# EAGLE schematic GPSClock (EAGLE 6.5.0)
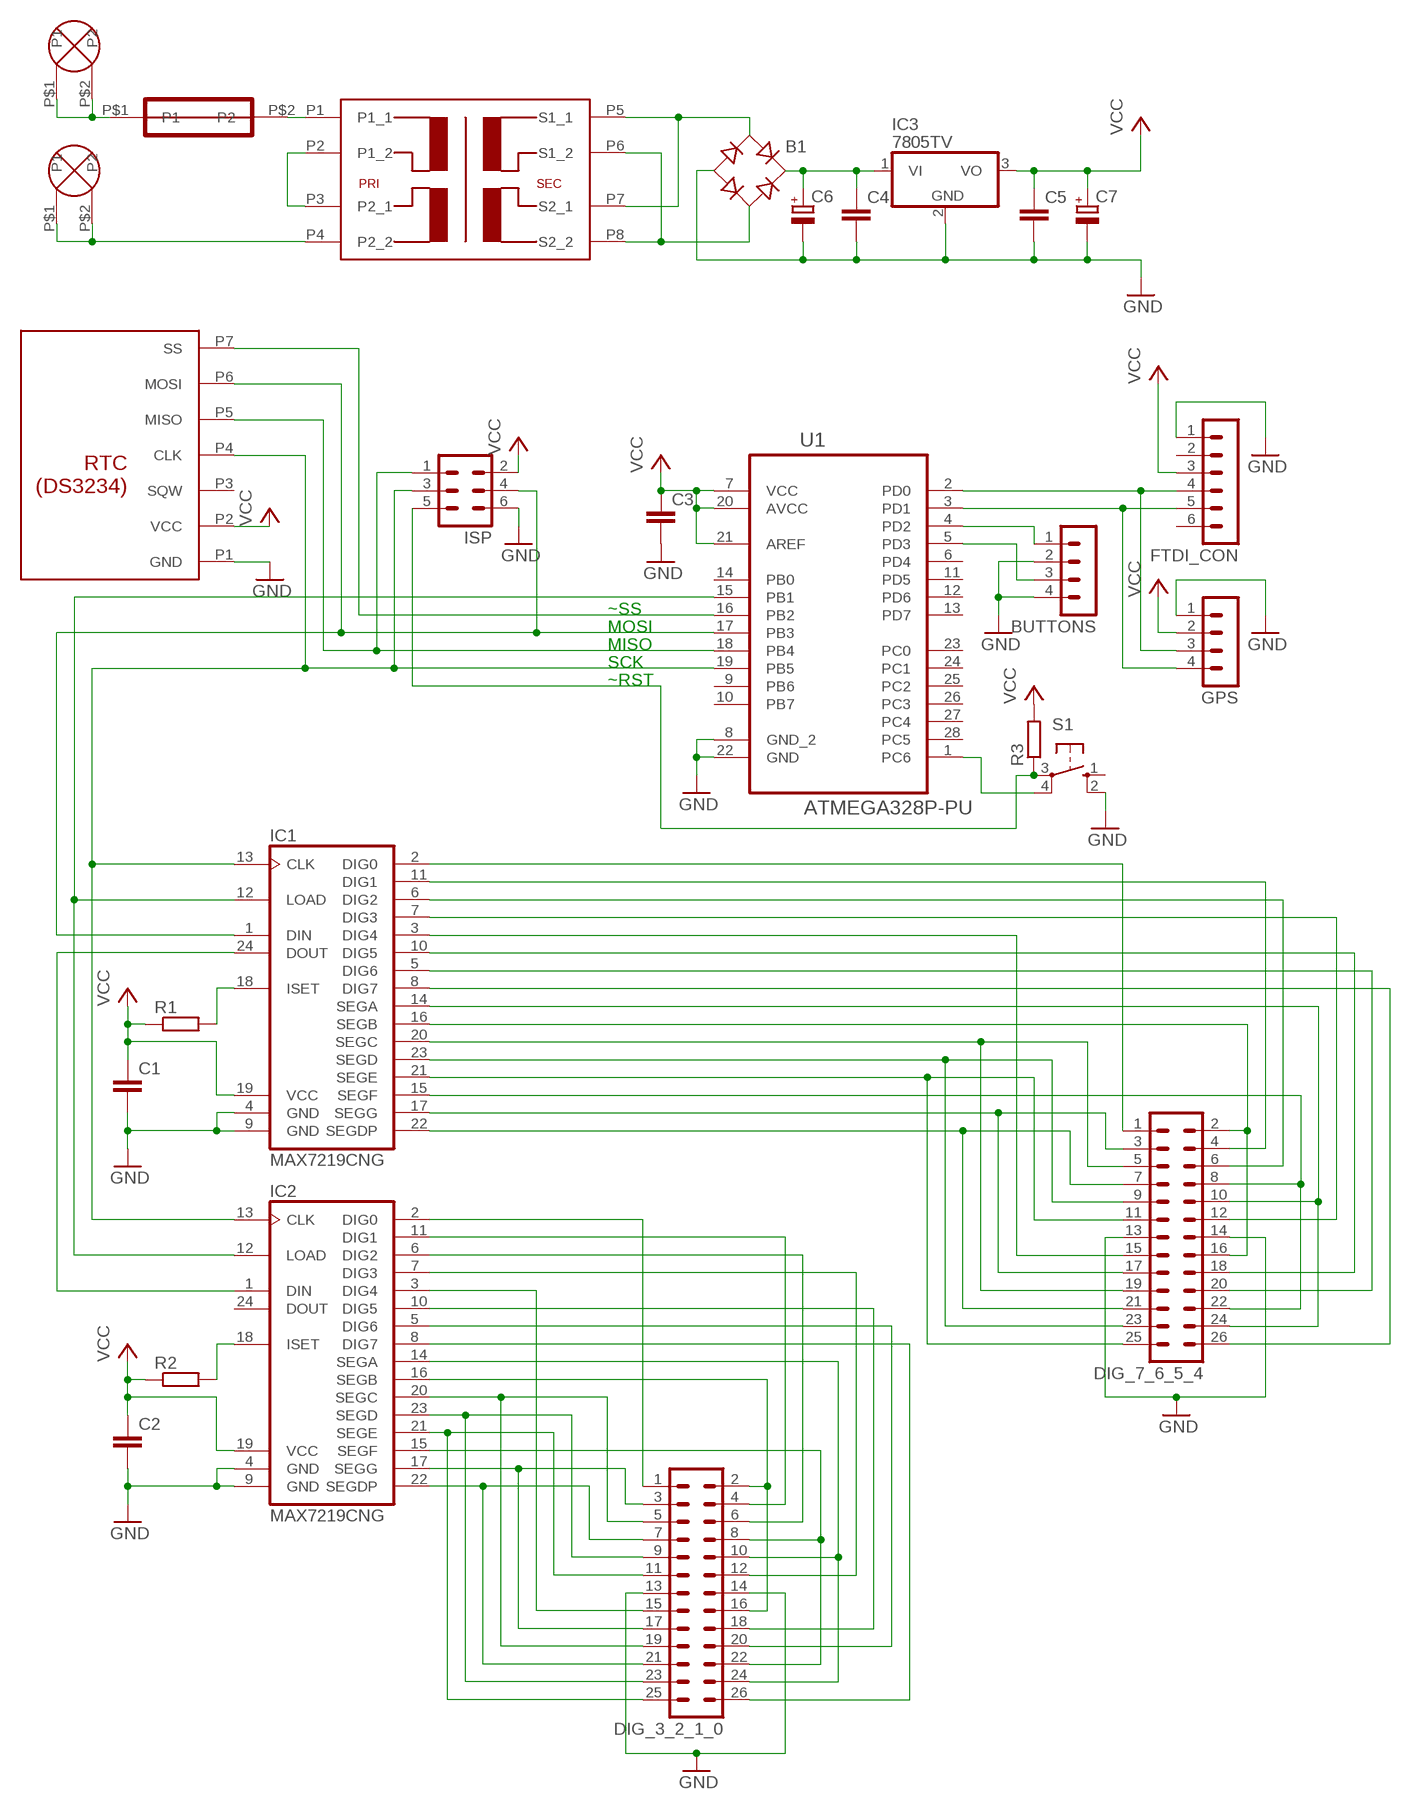
[diagram p0: schematic, sheet 1]

## Parts
B1  RB1A  [RB1A]
BUTTONS  MA04-1  [MA04-1]
C1  C-EU050-025X075  [C050-025X075]
C2  C-EU050-025X075  [C050-025X075]
C3  C-EU050-025X075  [C050-025X075]
C4  C-EU050-025X075  [C050-025X075]
C5  C-EU050-025X075  [C050-025X075]
C6  CPOL-EUE5-13  [E5-13]
C7  CPOL-EUE5-10.5  [E5-10,5]
DIG_3_2_1_0  ML26  [ML26]
DIG_7_6_5_4  ML26  [ML26]
FTDI_CON  MA06-1  [MA06-1]
GPS  MA04-1  [MA04-1]
IC1  MAX7219CNG  [DIL24-3]
IC2  MAX7219CNG  [DIL24-3]
IC3  7805TV  [TO220V]
ISP  ML6  [ML6]
R1  R-EU_0207/10  [0207/10]
R2  R-EU_0207/10  [0207/10]
R3  R-EU_0207/10  [0207/10]
S1  10-XX  [B3F-10XX]
U1  ATMEGA328P-PU  [DIP254P762X457-28]
U$1  TRAFO_M4312  [TRAFO_M4312]
U$2  SPADE_PCB  [SPADE_PCB]
U$3  SPADE_PCB  [SPADE_PCB]
U$4  FUSE_HOLDER  [FUSE_HOLDER]
U$5  RTC  [RTC]

## Nets
GND: B1.- BUTTONS.2 BUTTONS.4 C1.2 C2.2 C3.2 C4.2 C5.2 C6.- C7.- DIG_3_2_1_0.13 DIG_3_2_1_0.14 DIG_7_6_5_4.13 DIG_7_6_5_4.14 FTDI_CON.1 GPS.1 IC1.4(GND) IC1.9(GND) IC2.4(GND) IC2.9(GND) IC3.2(GND) ISP.6 S1.2(S1) U1.8(GND_2) U1.22(GND) U$5.P1(GND)
N$1: FTDI_CON.4 GPS.3 U1.2(PD0)
N$2: FTDI_CON.5 GPS.4 U1.3(PD1)
N$3: IC1.13(CLK) IC2.13(CLK) ISP.3 U1.19(PB5) U$5.P4(CLK)
N$4: ISP.1 U1.18(PB4) U$5.P5(MISO)
N$5: IC1.1(DIN) ISP.4 U1.17(PB3) U$5.P6(MOSI)
N$6: U1.16(PB2) U$5.P7(SS)
N$7: IC1.12(LOAD) IC2.12(LOAD) U1.15(PB1)
N$8: B1.AC1 U$1.P5(S1_1) U$1.P7(S2_1)
N$9: IC1.18(ISET) R1.2
N$10: IC2.18(ISET) R2.2
N$11: IC1.24(DOUT) IC2.1(DIN)
N$12: DIG_3_2_1_0.1 IC2.2(DIG0)
N$13: DIG_3_2_1_0.3 DIG_3_2_1_0.17 IC2.17(SEGG)
N$14: DIG_3_2_1_0.5 DIG_3_2_1_0.19 IC2.20(SEGC)
N$15: DIG_3_2_1_0.7 DIG_3_2_1_0.21 IC2.22(SEGDP)
N$16: DIG_3_2_1_0.9 DIG_3_2_1_0.23 IC2.23(SEGD)
N$17: DIG_3_2_1_0.11 DIG_3_2_1_0.25 IC2.21(SEGE)
N$18: DIG_3_2_1_0.15 IC2.3(DIG4)
N$19: DIG_3_2_1_0.2 DIG_3_2_1_0.16 IC2.16(SEGB)
N$20: DIG_3_2_1_0.4 IC2.11(DIG1)
N$21: DIG_3_2_1_0.6 IC2.6(DIG2)
N$22: DIG_3_2_1_0.8 DIG_3_2_1_0.22 IC2.15(SEGF)
N$23: DIG_3_2_1_0.10 DIG_3_2_1_0.24 IC2.14(SEGA)
N$24: DIG_3_2_1_0.12 IC2.7(DIG3)
N$25: DIG_3_2_1_0.18 IC2.10(DIG5)
N$26: DIG_3_2_1_0.20 IC2.5(DIG6)
N$27: DIG_3_2_1_0.26 IC2.8(DIG7)
N$28: DIG_7_6_5_4.1 IC1.2(DIG0)
N$29: DIG_7_6_5_4.3 DIG_7_6_5_4.17 IC1.17(SEGG)
N$30: DIG_7_6_5_4.5 DIG_7_6_5_4.19 IC1.20(SEGC)
N$31: DIG_7_6_5_4.7 DIG_7_6_5_4.21 IC1.22(SEGDP)
N$32: DIG_7_6_5_4.9 DIG_7_6_5_4.23 IC1.23(SEGD)
N$33: DIG_7_6_5_4.11 DIG_7_6_5_4.25 IC1.21(SEGE)
N$34: DIG_7_6_5_4.15 IC1.3(DIG4)
N$35: DIG_7_6_5_4.2 DIG_7_6_5_4.16 IC1.16(SEGB)
N$36: DIG_7_6_5_4.4 IC1.11(DIG1)
N$37: DIG_7_6_5_4.6 IC1.6(DIG2)
N$38: DIG_7_6_5_4.8 DIG_7_6_5_4.22 IC1.15(SEGF)
N$39: DIG_7_6_5_4.10 DIG_7_6_5_4.24 IC1.14(SEGA)
N$40: DIG_7_6_5_4.12 IC1.7(DIG3)
N$41: DIG_7_6_5_4.18 IC1.10(DIG5)
N$42: DIG_7_6_5_4.20 IC1.5(DIG6)
N$43: DIG_7_6_5_4.26 IC1.8(DIG7)
N$44: U$3.P$1(P1) U$3.P$2(P2) U$4.P$1(P1)
N$45: ISP.5 R3.1 S1.3(P)
N$46: BUTTONS.1 U1.4(PD2)
N$47: BUTTONS.3 U1.5(PD3)
N$48: S1.4(P1) U1.1(PC6)
N$49: U$1.P2(P1_2) U$1.P3(P2_1)
N$50: B1.+ C4.1 C6.+ IC3.1(VI)
N$51: U$1.P1(P1_1) U$4.P$2(P2)
N$52: U$1.P4(P2_2) U$2.P$1(P1) U$2.P$2(P2)
TRAN: B1.AC2 U$1.P6(S1_2) U$1.P8(S2_2)
VCC: C1.1 C2.1 C3.1 C5.1 C7.+ FTDI_CON.3 GPS.2 IC1.19(VCC) IC2.19(VCC) IC3.3(VO) ISP.2 R1.1 R2.1 R3.2 U1.7(VCC) U1.20(AVCC) U1.21(AREF) U$5.P2(VCC)
Unconnected: FTDI_CON.2 FTDI_CON.6 IC2.24(DOUT) S1.1(S) U1.6(PD4) U1.9(PB6) U1.10(PB7) U1.11(PD5) U1.12(PD6) U1.13(PD7) U1.14(PB0) U1.23(PC0) U1.24(PC1) U1.25(PC2) U1.26(PC3) U1.27(PC4) U1.28(PC5) U$5.P3(SQW)

## Notes on the sheet
- ~SS
- MOSI
- MISO
- SCK
- ~RST

## Library data of the parts
B1 = rectifier:RB1A: RECTIFIER 1 A
BUTTONS GPS = con-lstb:MA04-1: PIN HEADER; OC_FARNELL: unknown; OC_NEWARK: unknown
C1-C5 = rcl:C-EU: CAPACITOR, European symbol
C6 C7 = rcl:CPOL-EU: POLARIZED CAPACITOR, European symbol
DIG_3_2_1_0 DIG_7_6_5_4 = con-harting-ml:ML26: HARTING; OC_FARNELL: unknown; OC_NEWARK: unknown
FTDI_CON = con-lstb:MA06-1: PIN HEADER; OC_FARNELL: unknown; OC_NEWARK: unknown
IC1 IC2 = maxim:MAX7219CNG: LED DISPLAY DRIVER; MF: MAXIM; MPN: MAX7219CNG; OC_FARNELL: 1523914; OC_NEWARK: 34C4018
IC3 = linear:78*: Positive VOLTAGE REGULATOR Source: http://cache.national.com/ds/LM/LM78L05.pdf http://www.fairchildsemi.com/ds/LM/LM7805.pdf
ISP = con-harting-ml:ML6: HARTING; OC_FARNELL: unknown; OC_NEWARK: unknown
R1-R3 = rcl:R-EU_: RESISTOR, European symbol
S1 = switch-omron:10-XX: OMRON SWITCH; MPN: B3F-1000; OC_FARNELL: 176432; OC_NEWARK: 36M3542
U1 = Atmel_By_element14_Batch_1-00:ATMEGA328P-PU: 8-bit Microcontroller with In-System Programmable Flash; MPN: ATMEGA328P-PU; OC_FARNELL: 1715487; OC_NEWARK: 15R0268; PACKAGE: PDIP-28; SUPPLIER: Atmel
U$1 = Trafo_M4312:TRAFO_M4312
U$2 U$3 = Spade_PCB:SPADE_PCB
U$4 = FUSE_HOLDER:FUSE_HOLDER
U$5 = RTC:RTC